# EasyEDA schematic SCH_CLController.json
TITLE: CLController; REV: 1.0; Date: 2022-08-15; Sheet: 1/1; Company: CyrusBuilt
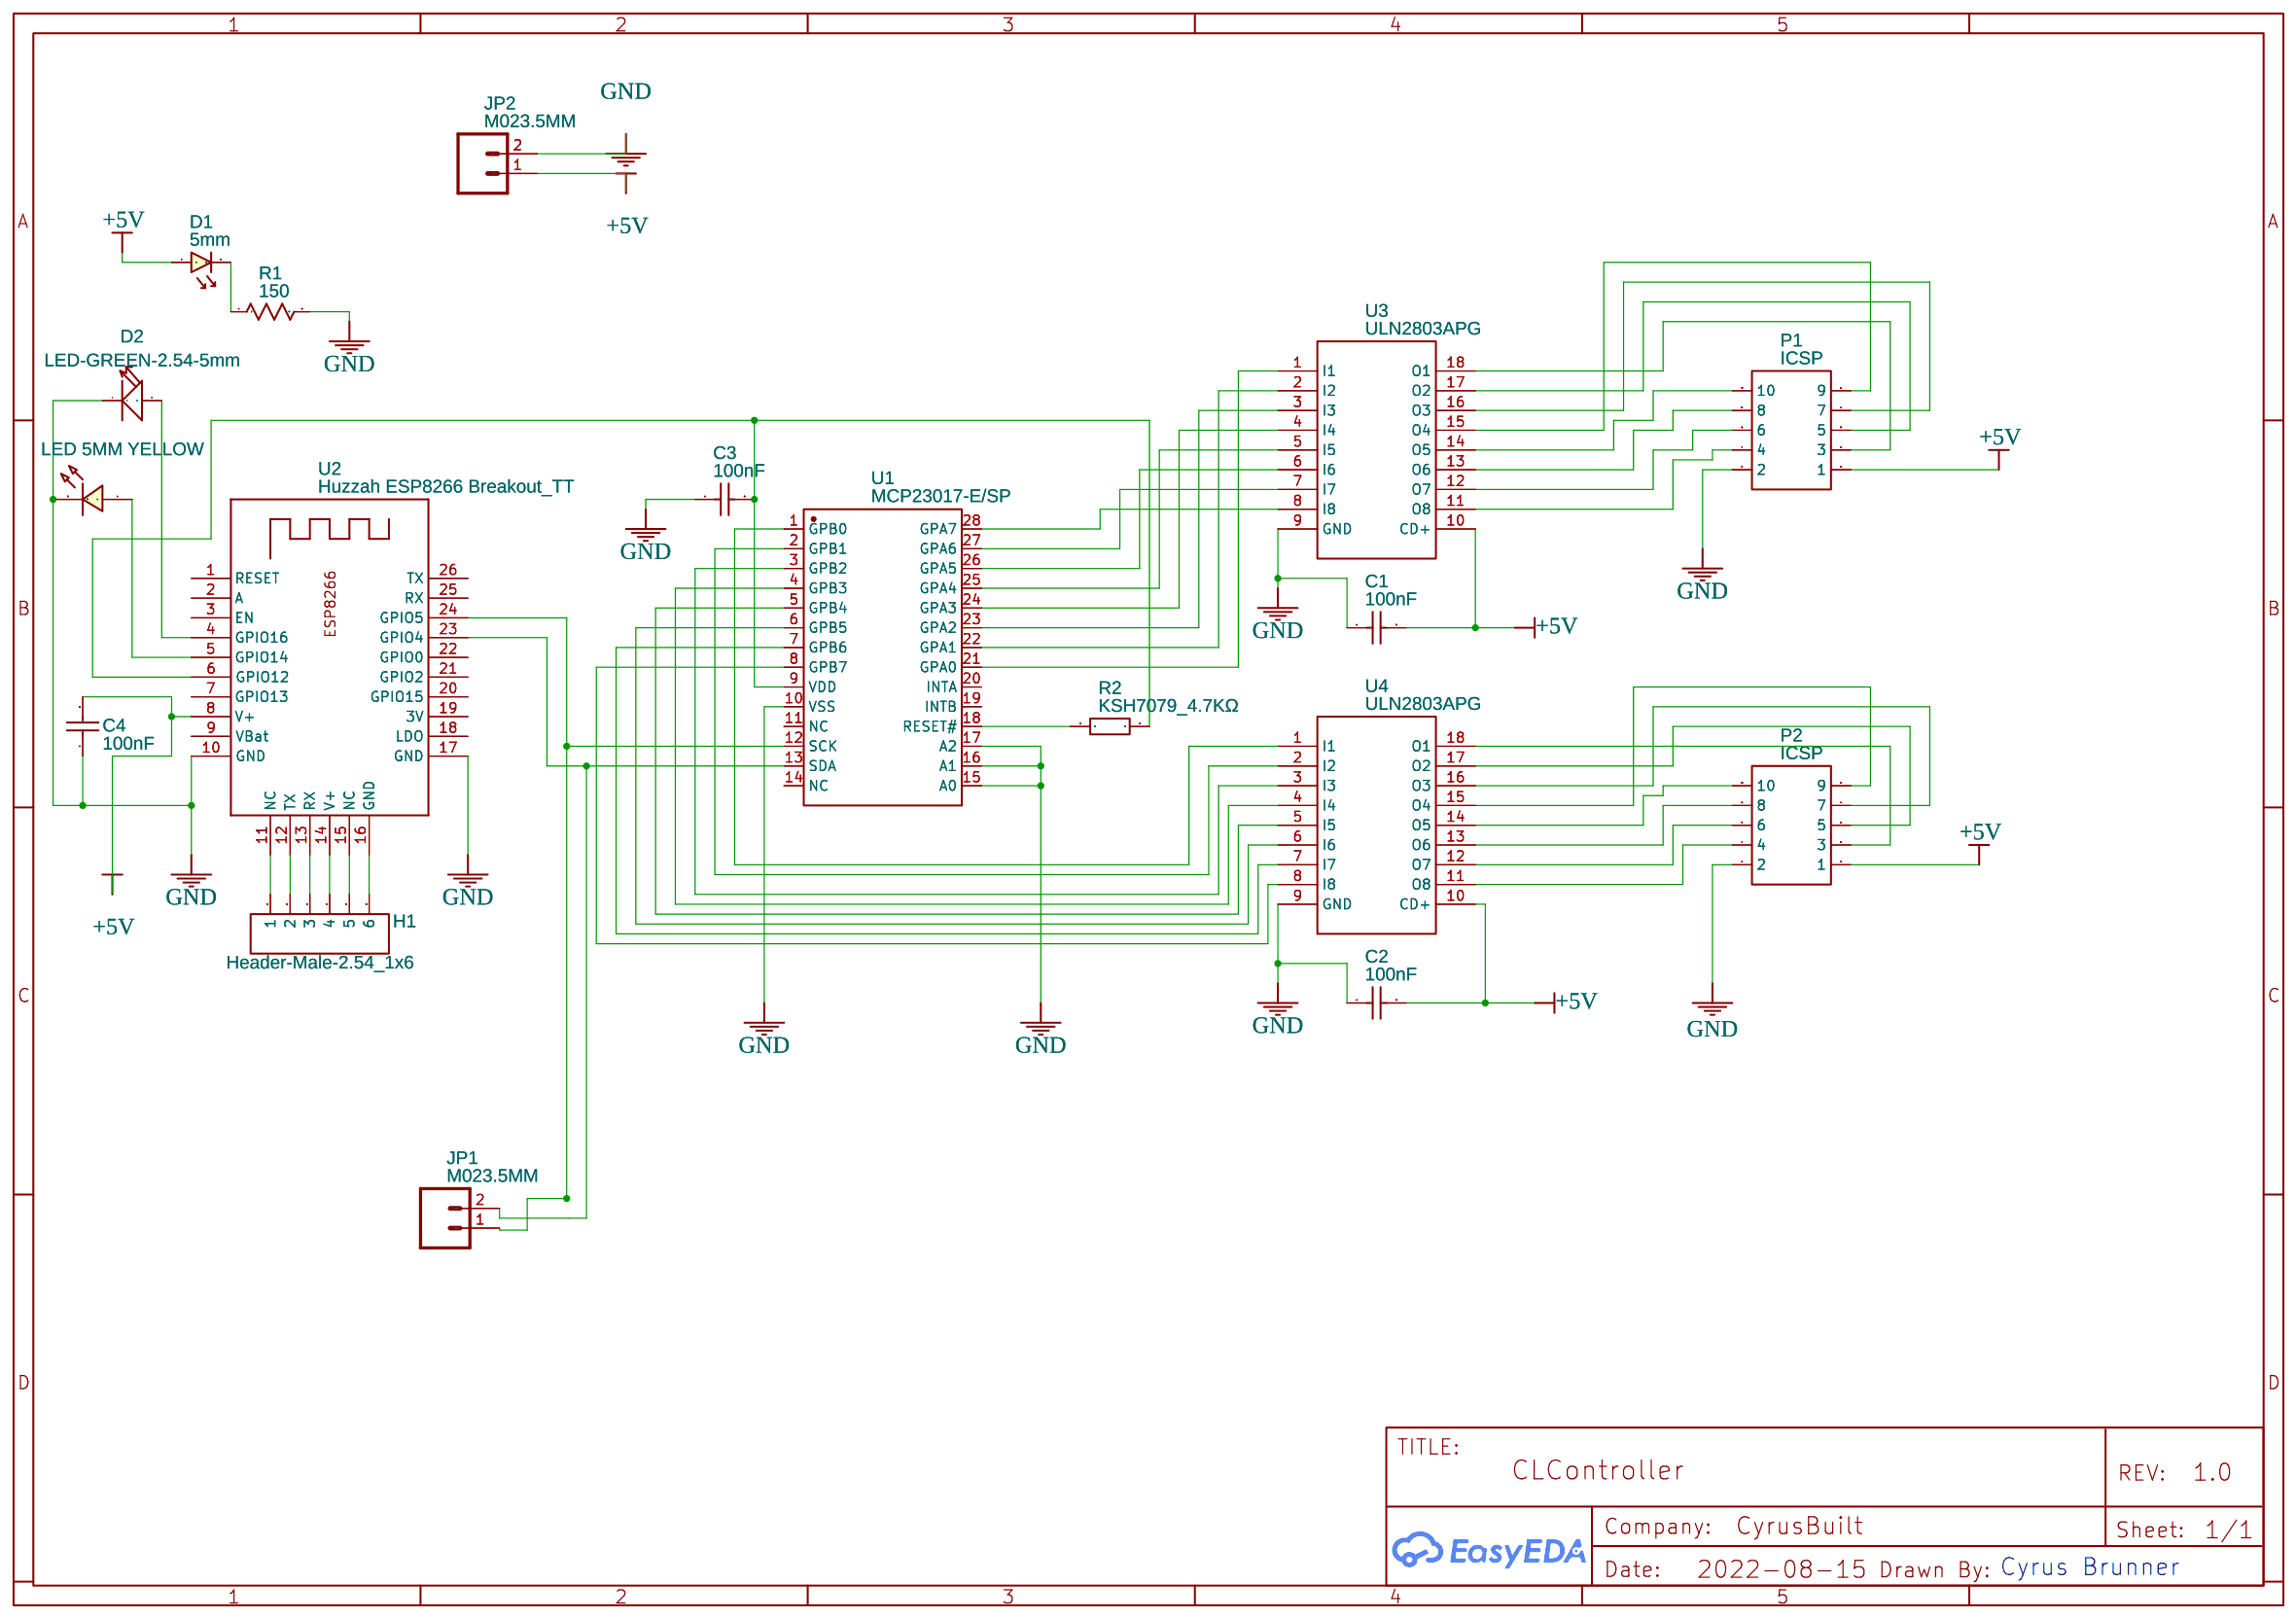
[diagram p0: schematic sheet]

## Parts
1  LED 5MM YELLOW  [LED 5MM YELLOW]
C1  100nF  [100NF]
C2  100nF  [100NF]
C3  100nF  [100NF]
C4  100nF  [100NF]
D1  5mm  [PKG-LED-5MM-RED]
D2  LED-GREEN-2.54-5mm  [LED-GREEN-2.54-5MM-YUN]
H1  Header-Male-2.54_1x6  [HDR-TH_6P-P2.54-V-M-1]
JP1  M023.5MM  [SCREWTERMINAL-3.5MM-2]
JP2  M023.5MM  [SCREWTERMINAL-3.5MM-2]
P1  ICSP  [HDR-IDC-2.54-2X5P]
P2  ICSP  [HDR-IDC-2.54-2X5P]
R1  150  [PKG-0.25W RESISTOR]
R2  KSH7079_4.7KΩ  [KSH7079_4.7KR]
U1  MCP23017-E/SP  [DIP-28_L35.0-W6.5-P2.54-LS7.6-BL]
U2  Huzzah ESP8266 Breakout_TT  [HUZZAH 8266]
U3  ULN2803APG  [ULN2803APG]
U4  ULN2803APG  [ULN2803APG]

## Library data of the parts
1 = LED 5MM YELLOW: Contributor: LCSC
C1-C4 = 100nF: Supplier: LCSC; Manufacturer: ReliaPro; Manufacturer Part: CT4-0805Y104M500; Contributor: LCSC; Supplier Part: C46756
D1 = L-1503EC: Color: Red; WaveLength: 617nm; Forward Voltage: 2.0V; Manufacturer: KINGBRIGHT; Supplier Part: 1003201; Supplier: Element14; link: http://www.farnell.com/datasheets/2046493.pdf?_ga=2.91228057.244688081.1505921947-238689616.1505921947&_gac=1.213042848.1505921947.EAIaIQobChMIsdP1s4y01gIVhxwbCh2_CAopEAAYASAAEgKnhPD_BwE; Contributor: Prof. Ing. F. Scordino
D2 = LED-GREEN-2.54-5mm: DIP LED Transparent-Orange;; Manufacturer Part: 503UOC; Contributor: koreawide
H1 = Header-Male-2.54_1x6: Supplier: LCSC; Manufacturer: BOOMELE; Supplier Part: C37208; JLCPCB Part Class: Extended Part
JP1 JP2 = M023.5MM: Contributor: CNC Projects by Marcus Volk
P1 P2 = ICSP: Supplier: LCSC; Manufacturer: BOOMELE; Manufacturer Part: IDC Box 2.54mm 2X5P; image: //image.lceda.cn/szlcsc/C5665.jpg; Supplier Part: C5665; Contributor: NewburyPi
R1 = MCF 0.25W 150R: Power: 1/4W; Tolerance: ±5%; Supplier Part: 9339175; Supplier: Element14; Manufacturer: MULTICOMP; link: http://www.farnell.com/datasheets/2861447.pdf; Contributor: Prof. Ing. F. Scordino
R2 = KSH7079_4.7KΩ: Power: 1/4W; Tolerance: ±1%; EasyEDA: E57439; Supplier Part: E57439; Supplier: EasyEDA; Manufacturer: UniOhm; Manufacturer Part: MFR0W4F2200A50; Contributor: ksh7079
U1 = MCP23017-E/SP: Supplier: LCSC; Supplier Part: C647352; Manufacturer: Microchip Tech; Contributor: LCSC; JLCPCB Part Class: Extended Part
U2 = Huzzah ESP8266 Breakout_TT: Manufacturer: Adafruit; link: https://www.adafruit.com/product/2471; Contributor: t_thompson92
U3 U4 = ULN2803APG: Supplier: LCSC; Manufacturer: TOSHIBA; image: //image.lceda.cn/szlcsc/C5252.jpg; Supplier Part: C5252; Contributor: binhtq

## Nets
+5V: C1.2 C2.2 C4.2 D1.1 JP2.1 P1.1 P2.1 U2.8(V+) U3.10(CD+) U4.10(CD+)
GND: 1.2 C1.1 C2.1 C3.1 C4.1 D2.- JP2.2 P1.2 P2.2 R1.2 U1.10(VSS) U1.15(A0) U1.16(A1) U1.17(A2) U2.10(GND) U2.17(GND) U3.9(GND) U4.9(GND)
Net-(1-1): 1.1 U2.5(GPIO14)
Net-(C3-2): C3.2 R2.2 U1.9(VDD) U2.6(GPIO12)
Net-(D1-2): D1.2 R1.1
Net-(D2-+): D2.+ U2.4(GPIO16)
Net-(H1-1): H1.1 U2.11(NC)
Net-(H1-2): H1.2 U2.12(TX)
Net-(H1-3): H1.3 U2.13(RX)
Net-(H1-4): H1.4 U2.14(V+)
Net-(H1-5): H1.5 U2.15(NC)
Net-(H1-6): H1.6 U2.16(GND)
Net-(JP1-1): JP1.1 U1.12(SCK) U2.24(GPIO5)
Net-(JP1-2): JP1.2 U1.13(SDA) U2.23(GPIO4)
Net-(P1-3): P1.3 U3.18(O1)
Net-(P1-4): P1.4 U3.11(O8)
Net-(P1-5): P1.5 U3.17(O2)
Net-(P1-6): P1.6 U3.12(O7)
Net-(P1-7): P1.7 U3.16(O3)
Net-(P1-8): P1.8 U3.13(O6)
Net-(P1-9): P1.9 U3.15(O4)
Net-(P1-10): P1.10 U3.14(O5)
Net-(P2-3): P2.3 U4.18(O1)
Net-(P2-4): P2.4 U4.11(O8)
Net-(P2-5): P2.5 U4.17(O2)
Net-(P2-6): P2.6 U4.12(O7)
Net-(P2-7): P2.7 U4.16(O3)
Net-(P2-8): P2.8 U4.13(O6)
Net-(P2-9): P2.9 U4.15(O4)
Net-(P2-10): P2.10 U4.14(O5)
Net-(R2-1): R2.1 U1.18(RESET#)
Net-(U1-1): U1.1(GPB0) U4.1(I1)
Net-(U1-2): U1.2(GPB1) U4.2(I2)
Net-(U1-3): U1.3(GPB2) U4.3(I3)
Net-(U1-4): U1.4(GPB3) U4.4(I4)
Net-(U1-5): U1.5(GPB4) U4.5(I5)
Net-(U1-6): U1.6(GPB5) U4.6(I6)
Net-(U1-7): U1.7(GPB6) U4.7(I7)
Net-(U1-8): U1.8(GPB7) U4.8(I8)
Net-(U1-21): U1.21(GPA0) U3.1(I1)
Net-(U1-22): U1.22(GPA1) U3.2(I2)
Net-(U1-23): U1.23(GPA2) U3.3(I3)
Net-(U1-24): U1.24(GPA3) U3.4(I4)
Net-(U1-25): U1.25(GPA4) U3.5(I5)
Net-(U1-26): U1.26(GPA5) U3.6(I6)
Net-(U1-27): U1.27(GPA6) U3.7(I7)
Net-(U1-28): U1.28(GPA7) U3.8(I8)

Not connected (* = marked no-connect by the designer): U1 11(NC) 14(NC) 19(INTB) 20(INTA); U2 1(RESET) 2(A) 3(EN) 7(GPIO13) 9(VBat) 18(LDO) 19(3V) 20(GPIO15) 21(GPIO2) 22(GPIO0) 25(RX) 26(TX)

## Notes on the sheet
- Cyrus Brunner
